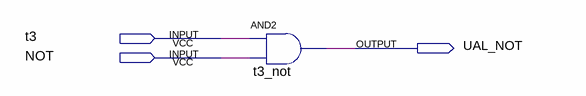
[diagram p0: schematic sheet]
// Quartus schematic ual_not.bdf as structural Verilog: 1 symbols, 3 pins
module ual_not (
  input  t3,
  input  NOT,
  output UAL_NOT
);

  and t3_not (UAL_NOT, t3, NOT);
endmodule
